# Altium project CSI2-RPI-NANO_Rev01.PrjPcb
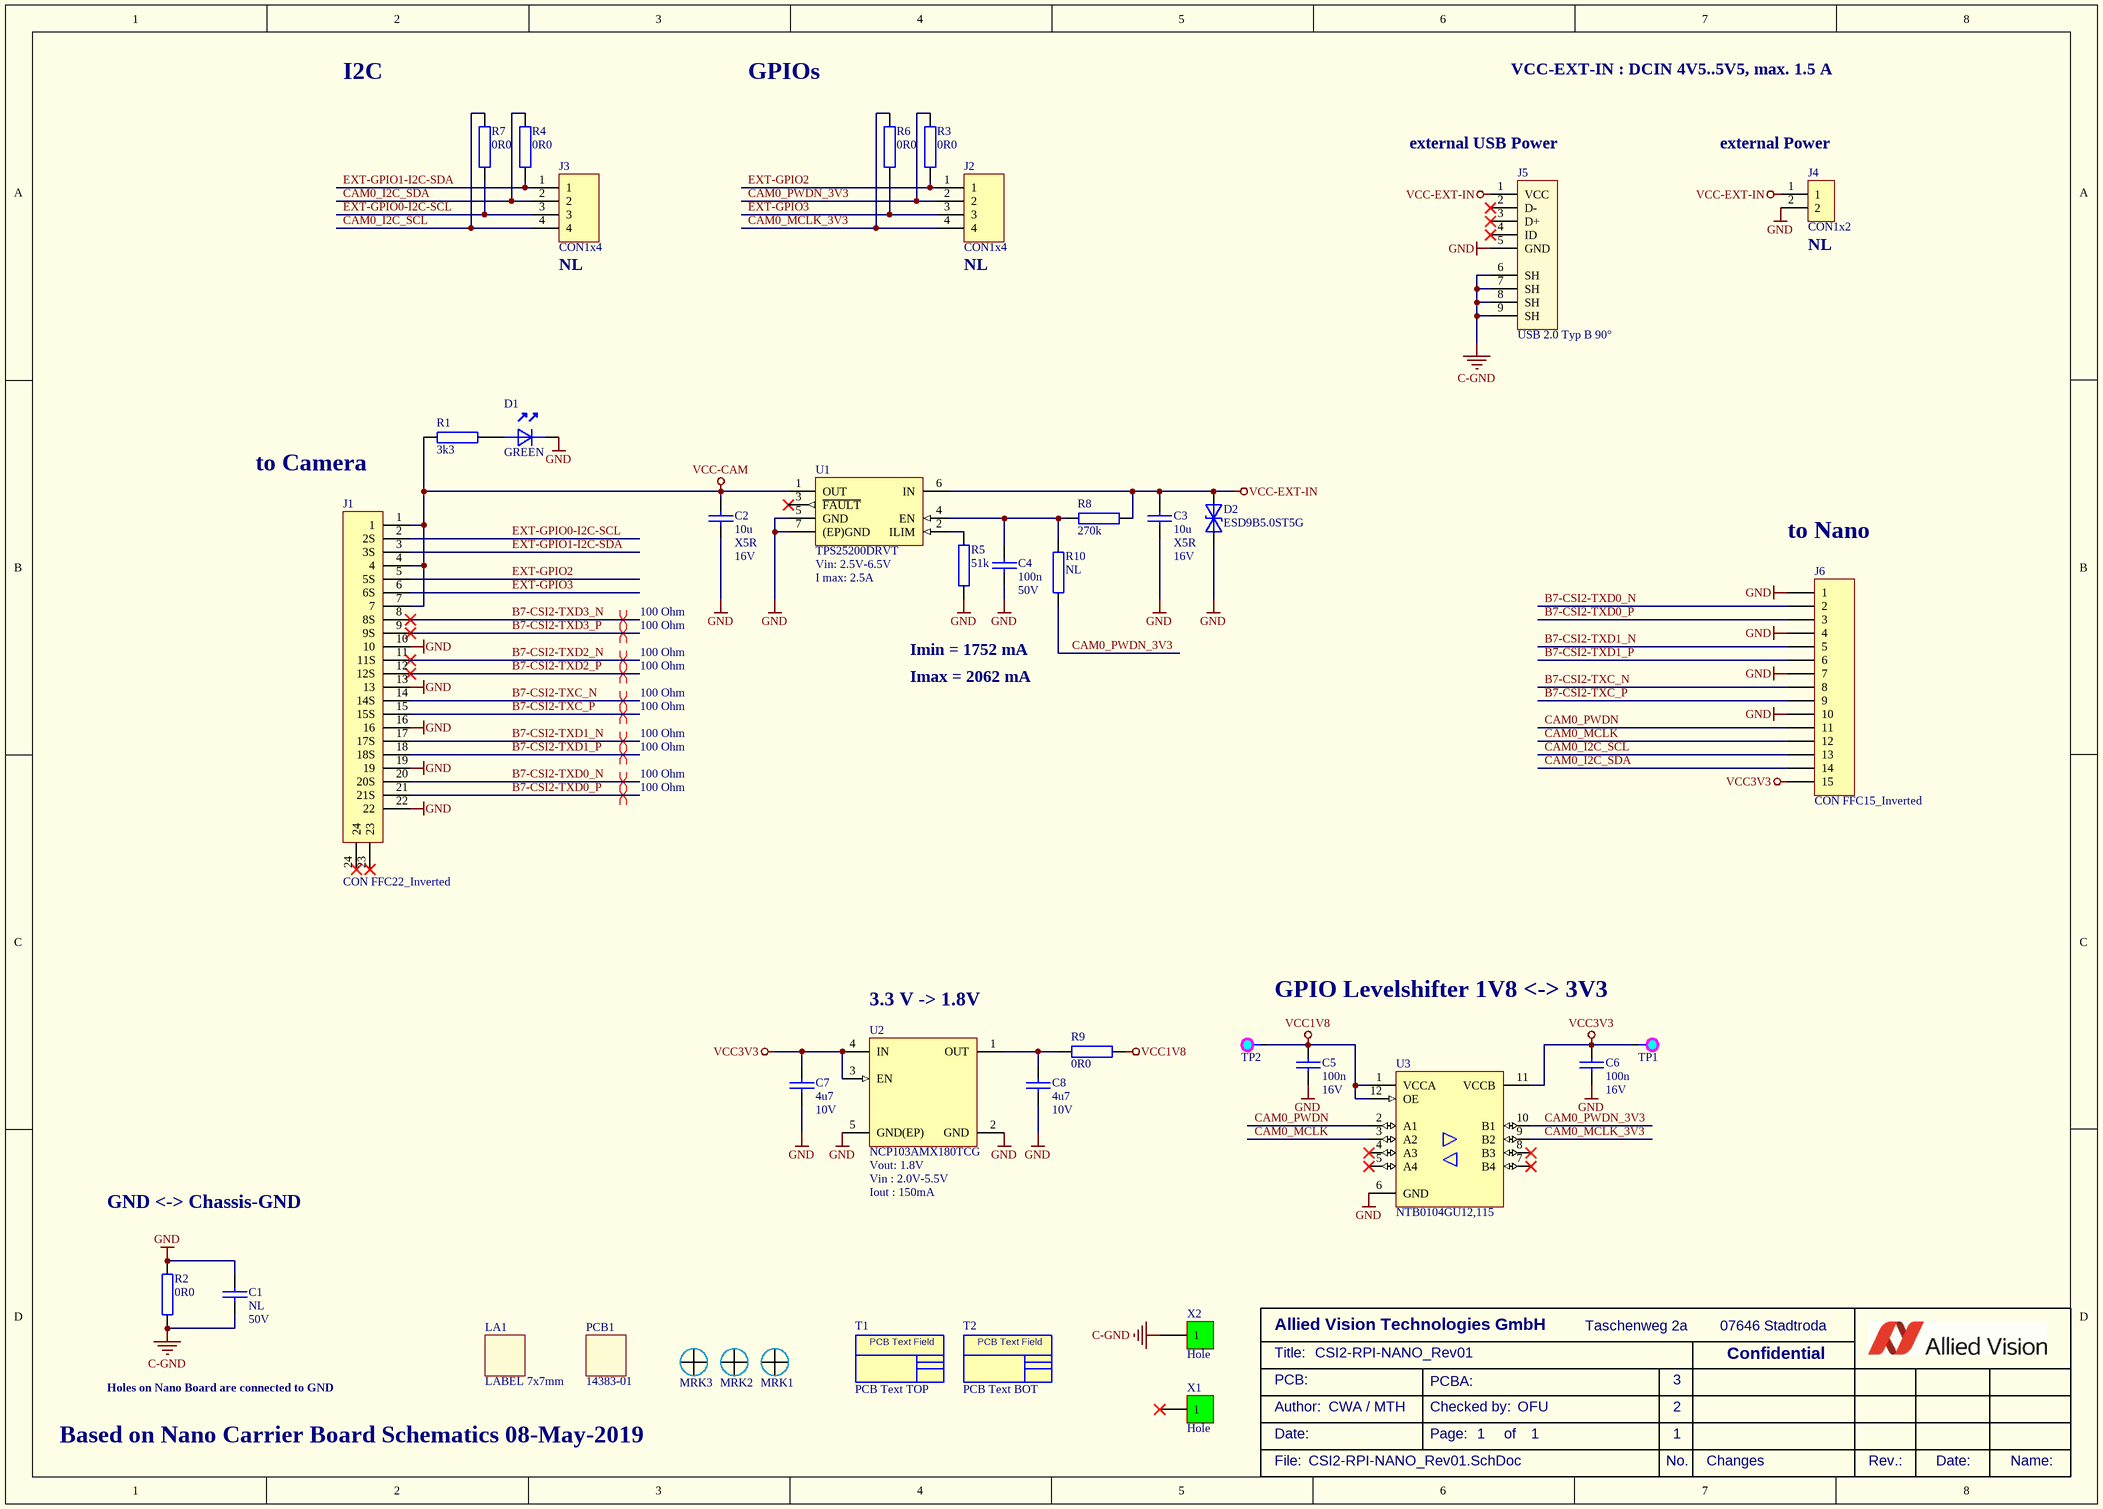
[diagram p0: CSI2-RPI-NANO_Rev01.SchDoc]
VariantName: standard; Title: CSI2-RPI-NANO_Rev01; RevisionPCB: 01; AuthorPCB: MTH; _ProjectName: CSI2-RPI-NANO
1 sheet, 40 parts. Net scope: global (net labels, ports and power ports of the same name join across sheets).
Board file: CSI2-RPI-NANO_Rev01.PcbDoc

## Sheet CSI2-RPI-NANO_Rev01.SchDoc: CSI2-RPI-NANO_Rev01
size A3; PageSetup: Record=PageOptions|CenterHorizontal=True|CenterVertical=True|PrintScale=0.73|XCorrection=1.00|YCorrection=1.00|PrintKind=2|BorderSize=5000000|LeftOffset=0|BottomOffset=0|Orientation=2|PaperLength=1000|PaperWidth=1000|Scale=100|PaperSource=7|PrintQuality=-4|MediaType=1|DitherType=10|PrintScaleMode=1|PaperKind=A3; CheckedBy: OFU; Author: CWA / MTH; CompanyName: Allied Vision Technologies GmbH; Address1: Taschenweg 2a; Address2: 07646 Stadtroda; Address3: Germany; Revision: 01; SheetNumber: 1; SheetTotal: 1

### Parts
C1  NL  Voltage: 50V  [C-0603_1.0]
C2  10u  Dielectric: X5R  Voltage: 16V  [C-0805_1.4]
C3  10u  Dielectric: X5R  Voltage: 16V  [C-0805_1.4]
C4  100n  Voltage: 50V  [C-0603_1.0]
C5  100n  Voltage: 16V  [C-0402_0.55]
C6  100n  Voltage: 16V  [C-0402_0.55]
C7  4u7  Voltage: 10V  [C-0603_1.0]
C8  4u7  Voltage: 10V  [C-0603_1.0]
D1  GREEN  [D-0603-LED]
D2  ESD9B5.0ST5G  [D-SOD923]
J1  CON FFC22_Inverted  [J-FH55-22S-0.5SH - Inverted Pins]
J2  CON1x4  [CON 1x4 RM2.54]
J3  CON1x4  [CON 1x4 RM2.54]
J4  CON1x2  [CON 1x2 RM2.54]
J5  USB 2.0 Typ B 90°  [J-629105150521]
J6  CON FFC15_Inverted  [J-1-1734248-5 - Inverted Pins]
LA1  LABEL 7x7mm  [PCB LABEL 7x7]
MRK1  Marker Single Layer  [PCB_Marker_Pad_top]  (value not drawn)
MRK2  Marker Single Layer  [PCB_Marker_Pad_top]  (value not drawn)
MRK3  Marker Single Layer  [PCB_Marker_Pad_top]  (value not drawn)
PCB1  14383-01  (mechanical)
R1  3k3  [R-0603_0.6]
R2  0R0  [R-0603_0.6]
R3  0R0  [R-0603_0.6]
R4  0R0  [R-0603_0.6]
R5  51k  [R-0603_0.6]
R6  0R0  [R-0603_0.6]
R7  0R0  [R-0603_0.6]
R8  270k  [R-0603_0.6]
R9  0R0  [R-0603_0.6]
R10  NL  [R-0603_0.6]
T1  PCB Text TOP  [PCB TEXTFIELD TOP 2]  (no BOM)
T2  PCB Text BOT  [PCB TEXTFIELD BOT 2]  (no BOM)
TP1  TP  [TP_16_10]  (value not drawn)  (no BOM)
TP2  TP  [TP_16_10]  (value not drawn)  (no BOM)
U1  TPS25200DRVT  Vin: 2.5V-6.5V  I max: 2.5A  [IC-DFN06_2.0x2.0x0.8]
U2  NCP103AMX180TCG  Vout: 1.8V  Vin: Vin : 2.0V-5.5V  Iout: Iout : 150mA  [IC-XDFN4_1.0x1.0x0.6]
U3  NTB0104GU12,115  [IC-XQFN12_1.7x2x0.5]
X1  Hole  [HOLE-2.6-5.0-DK]  (no BOM)
X2  Hole  [HOLE-2.6-5.0-DK]  (no BOM)

### Nets
C-GND: C1.2 J5.6(SH) J5.7(SH) J5.8(SH) J5.9(SH) R2.1 X2.1
GND: C1.1 C2.2 C3.2 C4.2 C5.2 C6.2 C7.2 C8.2 D1.K D2.A J1.10 J1.13 J1.16 J1.19 J1.22 J4.2 J5.5(GND) J6.1 J6.4 J6.7 J6.10 R2.2 R5.1 U1.5(GND) U1.7((EP)GND) U2.2(GND) U2.5(GND(EP)) U3.6(GND)
VCC1V8: C5.1 R9.2 TP2.1 U3.1(VCCA) U3.12(OE)
VCC3V3: C6.1 C7.1 J6.15 TP1.1 U2.3(EN) U2.4(IN) U3.11(VCCB)
VCC-CAM: C2.1 J1.1 J1.4 J1.7 R1.1 U1.1(OUT)
VCC-EXT-IN: C3.1 D2.K J4.1 J5.1(VCC) R8.2 U1.6(IN)
B7-CSI2-TXC_N: J1.14(14S) J6.8
B7-CSI2-TXC_P: J1.15(15S) J6.9
B7-CSI2-TXD0_N: J1.20(20S) J6.2
B7-CSI2-TXD0_P: J1.21(21S) J6.3
B7-CSI2-TXD1_N: J1.17(17S) J6.5
B7-CSI2-TXD1_P: J1.18(18S) J6.6
B7-CSI2-TXD2_N: J1.11(11S)
B7-CSI2-TXD2_P: J1.12(12S)
B7-CSI2-TXD3_N: J1.8(8S)
B7-CSI2-TXD3_P: J1.9(9S)
CAM0_I2C_SCL: J3.4 J6.13 R7.2
CAM0_I2C_SDA: J3.2 J6.14 R4.2
CAM0_MCLK: J6.12 U3.3(A2)
CAM0_MCLK_3V3: J2.4 R6.2 U3.9(B2)
CAM0_PWDN: J6.11 U3.2(A1)
CAM0_PWDN_3V3: J2.2 R3.2 R10.1 U3.10(B1)
EXT-GPIO0-I2C-SCL: J1.2(2S) J3.3 R7.1
EXT-GPIO1-I2C-SDA: J1.3(3S) J3.1 R4.1
EXT-GPIO2: J1.5(5S) J2.1 R3.1
EXT-GPIO3: J1.6(6S) J2.3 R6.1
NetC4_1: C4.1 R8.1 R10.2 U1.4(EN)
NetC8_1: C8.1 R9.1 U2.1(OUT)
NetD1_A: D1.A R1.2
NetR5_2: R5.2 U1.2(ILIM)

Not connected (* = marked no-connect by the designer): J1 23* 24*; J5 2(D-)* 3(D+)* 4(ID)*; U1 3(~{FAULT})*; U3 4(A3)* 5(A4)* 7(B4)* 8(B3)*; X1 1*

### Layout directives
differential pair; net class 100 Ohm: B7-CSI2-TXC_N, B7-CSI2-TXC_P, B7-CSI2-TXD0_N, B7-CSI2-TXD0_P, B7-CSI2-TXD1_N, B7-CSI2-TXD1_P, B7-CSI2-TXD2_N, B7-CSI2-TXD2_P, B7-CSI2-TXD3_N, B7-CSI2-TXD3_P

### Notes on the sheet
- I2C
- GPIOs
- VCC-EXT-IN : DCIN 4V5..5V5, max. 1.5 A
- (near J5) external USB Power
- (near J4) external Power
- (near J3) NL
- (near J2) NL
- (near J4) NL
- to Camera
- (near J6) to Nano
- Imin = 1752 mA
- Imax = 2062 mA
- (near U2) 3.3 V -> 1.8V
- GPIO Levelshifter 1V8 <-> 3V3
- GND <-> Chassis-GND
- Holes on Nano Board are connected to GND
- Based on Nano Carrier Board Schematics 08-May-2019
- Title:
- PCB:
- PCBA:
- 3
- Confidential
- Author:
- Date:
- Checked by:
- Page:
- of
- 1
- 2
- File:
- No.
- Changes
- Rev.:
- Name:
- (in symbol PCB TEXT FIELD BOT) PCB Text Field
- (in symbol PCB TEXT FIELD TOP) PCB Text Field

### Library data of the parts
C1 = C X 0603: Capacitor Ceramic SMD/0603/50V/X7R/10%; Manufacturer: several; Dielectric: X7R; Tolerance: 10%; Manufacturer Part Number: several
C2 C3 = C 10U 16V X5R 0805: Capacitor Ceramic SMD/0805/16V/X5R/10%; KHK Part Number: K8340151; Manufacturer: several; Tolerance: 10%; Manufacturer Part Number: several
C4 = C 100N 50V X7R 0603: Capacitor Ceramic SMD/0603/50V/X7R/10%; KHK Part Number: K8340023; Manufacturer: several; Dielectric: X7R; Tolerance: 10%; Manufacturer Part Number: several
C5 C6 = C 100N 10% 16V X7R 402: Capacitor Ceramic SMD/0402/16V/X7R/10%; KHK Part Number: K8340114; Manufacturer: several; Dielectric: X7R; Tolerance: 10%; Manufacturer Part Number: several
C7 C8 = C 4U7 10V X5R 0603: Capacitor Ceramic SMD/0603/10V/X5R/10%; KHK Part Number: 1431; Manufacturer: several; Dielectric: X5R; Tolerance: 10%; Manufacturer Part Number: several
D1 = D LED 0603 green: Chip LED green 430mcd; KHK Part Number: 8172; Manufacturer: Würth; Manufacturer Part Number: 150060GS75000; Current: 20mA; Color: green
D2 = D ESD9B5.0ST5G: DIODE TVS; 400W; 5.8-7.8V; BIDIRECT; KHK Part Number: 7250; Manufacturer: ON Semiconductor; Manufacturer Part Number: ESD9B5.0ST5G
J1 = CON FFC22_FH55-22S-0.5SH_Inverted: FFC Connector 0.5mm shielded; KHK Part Number: 10357; Manufacturer: Hirose; Manufacturer Part Number: FH55-22S-0.5SH
J2 J3 = CON 1x4 2.54: Stiftleiste; 1x4; 2.54mm; gerade; Manufacturer: Harwin; Manufacturer Part Number: M20-999 0445; KHK Part Number: K7600564
J4 = CON 1x2 2.54: Stiftleiste; 1x2; 2.54mm; gerade; Manufacturer: fischer elektronik; Manufacturer Part Number: SL 11 124 2 G; KHK Part Number: K7600582
J5 = CON USB 2.0 Typ B 90°: Micro USB 2.0 Typ B 90°; KHK Part Number: 14360; Manufacturer: WE; Manufacturer Part Number: 629 105 150 521
J6 = CON FFC15_1-1734248-5_Inverted: FFC Connector 1mm; Manufacturer: TE; Manufacturer Part Number: 1-1734248-5
LA1 = PCB LABEL 7x7: Manufacturer: several; Manufacturer Part Number: several
MRK1-MRK3 = PCB Marker Pad Single Layer: Position Marker for PCBs
PCB1 = PCB: PCB ML04; KHK Part Number: 14377-01; Manufacturer: several; Manufacturer Part Number: 14377-01
R1 = R 3K3 1% 0603: Standard Resistor SMD/0603/1%/100mW/TK100; KHK Part Number: K8250070; Manufacturer: several; Tolerance: 1%; Manufacturer Part Number: several
R2 R3 R6 = R 0R0 1% 0603: Standard Resistor SMD/0603/1%/100mW/TK200; KHK Part Number: K8250041; Manufacturer: several; Tolerance: 1%; Manufacturer Part Number: several; Temperature Coefficient: *
R4 R7 R9 = R 0R0 1% 0603: Standard Resistor SMD/0603/1%/100mW/TK100; KHK Part Number: K8250041; Manufacturer: several; Tolerance: 1%; Manufacturer Part Number: several; Temperature Coefficient: *
R5 = R 51K 1% 0603: Standard Resistor SMD/0603/1%/100mW/TK100; KHK Part Number: K8250156; Manufacturer: several; Tolerance: 1%; Manufacturer Part Number: several
R8 = R 270K 1% 0603: Standard Resistor SMD/0603/1%/100mW/TK100; KHK Part Number: K8250170; Manufacturer: several; Tolerance: 1%; Temperature Coefficient: na; Manufacturer Part Number: several
R10 = R X 0603: Standard Resistor SMD/0603/1%/100mW/TK200; Tolerance: 1%; Temperature Coefficient: TK100
T1 = PCB TEXT FIELD TOP: PCB Textfield TOP
T2 = PCB TEXT FIELD BOT: PCB Textfield BOT
TP1 TP2 = TP_16_10: Testpoint: Pad=1,6mm; Hole=1,0mm
U1 = IC  TPS25200DRVT: IC/PWR/LOADSW;2V5-6V5;2A5;0R099/6-WDFN/2x2x0.8mm; KHK Part Number: 14277; Manufacturer: Texas Instruments; Manufacturer Part Number: TPS25200DRVT
U2 = IC NCP103AMX180TCG: IC/PWR/LDO;2V0-5V5;1V8;0A150/uDFN4/1x1x0.6mm; KHK Part Number: 14922; Manufacturer: ON Semi; Manufacturer Part Number: NCP103AMX180TCG
U3 = IC NTB0104GU12,115: IC/LOGIC/Levelshifter;Auto-Dir;Bidirectional;Push-Pull;-40-+125°C/; Manufacturer: NXP; KHK Part Number: 14383; Manufacturer Part Number: NTB0104GU12,115
X1 X2 = PCB HOLE M2.5-5-DK: HOLE M2.5

## Assembly variants
standard: all parts fitted